# Altium schematic sheet E3Z 漫反射电子器件位置 - w版本2 20260606.SchDoc
size A1
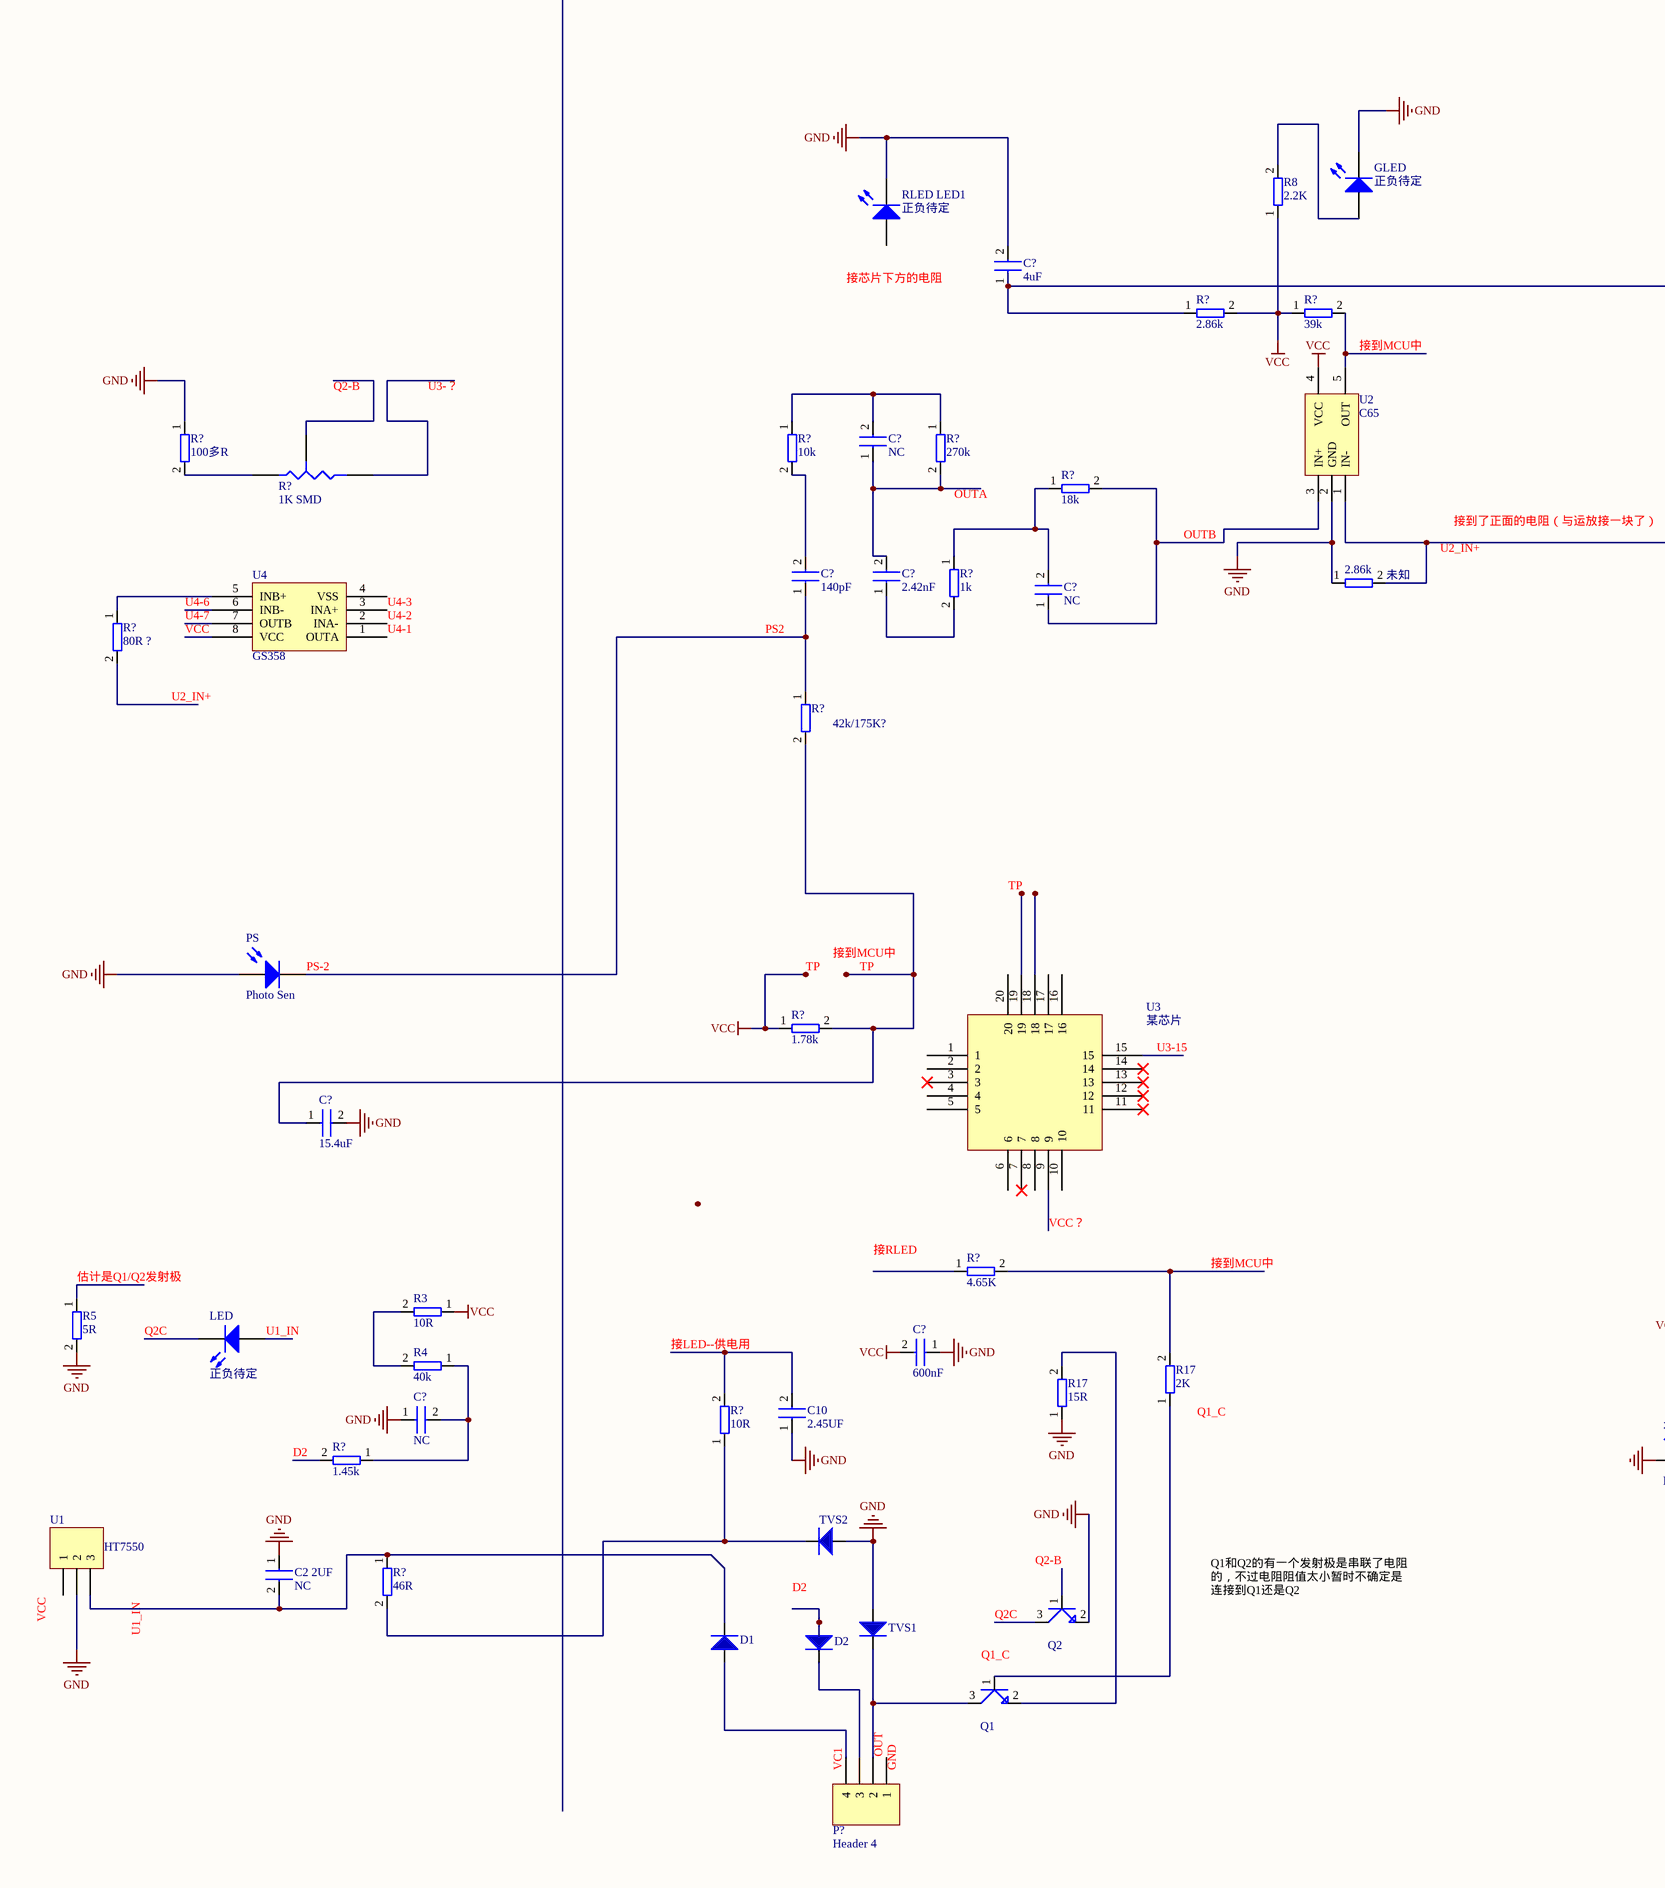
[diagram p0: E3Z 漫反射电子器件位置 - w版本2 20260606.SchDoc, left]
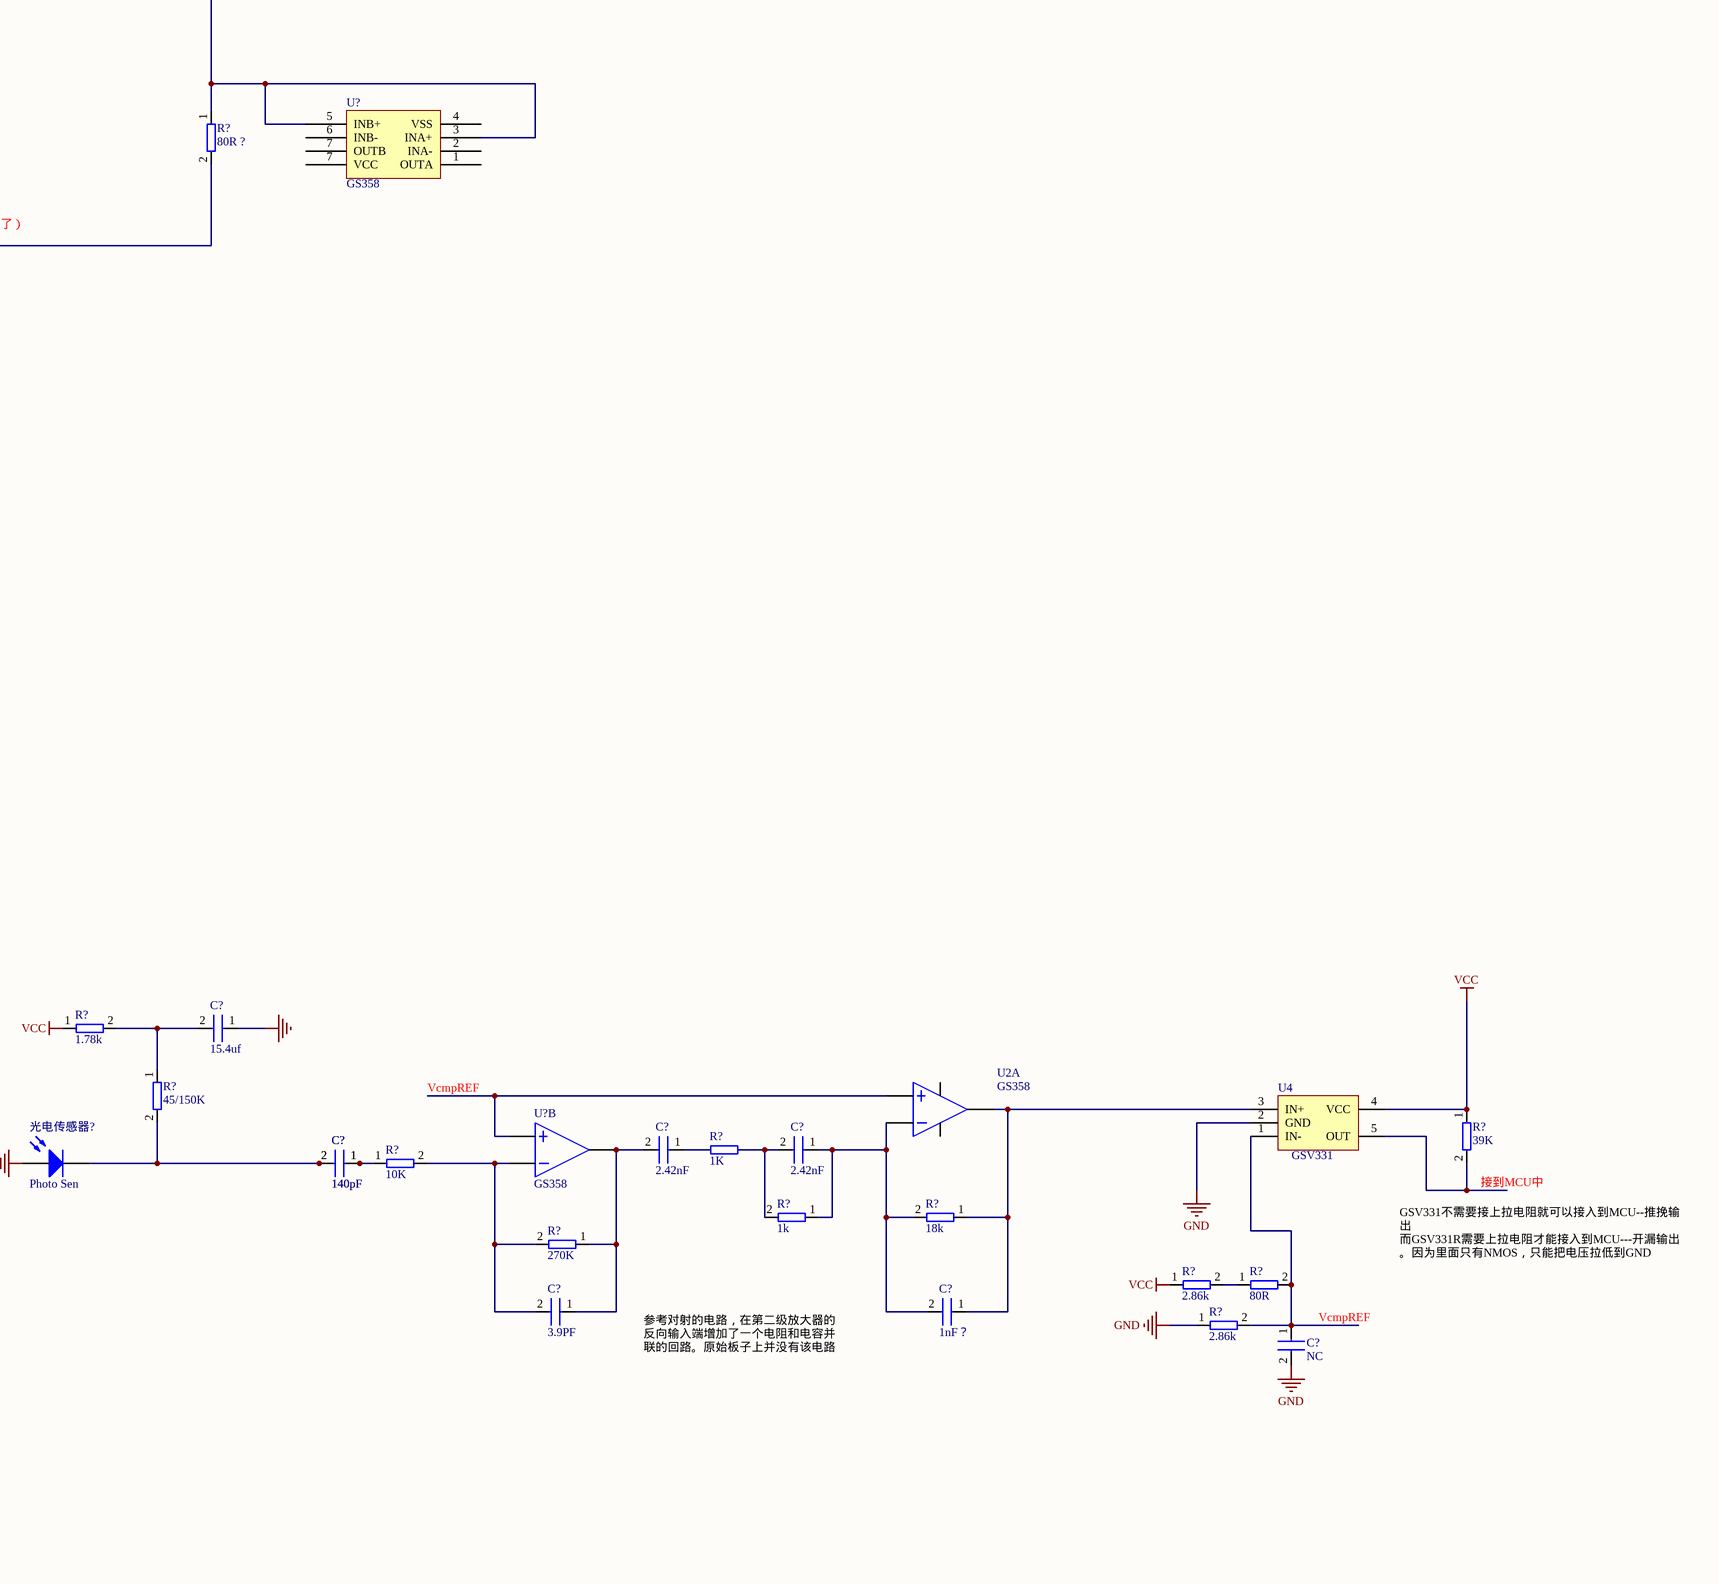
[diagram p1: E3Z 漫反射电子器件位置 - w版本2 20260606.SchDoc, right]

## Parts
(Parts that share a designator on the sheet are numbered #1, #2 ... from top to bottom, then left to right.)
2.86k  未知
C2_2UF  NC
C10  2.45UF
C?#1  4uF
C?#2  NC
C?#3  140pF
C?#4  2.42nF
C?#5  NC
C?#6  15.4uF
C?#7  15.4uf
C?#8  600nF
C?#9  NC
C?#10  2.42nF
C?#11  2.42nF
C?#12  140pF
C?#13  140pF
C?#14  3.9PF
C?#15  1nF？
C?#16  NC
D1  (no value)
D2  (no value)
GLED  正负待定  [LED-0]
LED  正负待定  [LED-0]
P?  Header 4  [HDR1X4]
PS  Photo Sen  [PIN2]
Q1  2SC4617TLR  (value not drawn)
Q2  2SC4617TLR  (value not drawn)
R3  10R
R4  40k
R5  5R
R8  2.2K
R17#1  2K
R17#2  15R
R?#1  2.86k
R?#2  39k
R?#3  80R ?
R?#4  100多R
R?#5  10k
R?#6  270k
R?#7  value 1K SMD  [VR3]  (hidden comment: Res Tap)
R?#8  18k
R?#9  1k
R?#10  80R ?
R?#11  42k/175K?
R?#12  1.78k
R?#13  4.65K
R?#14  1.78k
R?#15  45/150K
R?#16  39K
R?#17  10R
R?#18  1K
R?#19  1.45k
R?#20  10K
R?#21  1k
R?#22  18k
R?#23  270K
R?#24  46R
R?#25  2.86k
R?#26  80R
R?#27  2.86k
RLED_LED1  正负待定  [LED-0]
TVS1  (no value)
TVS2  (no value)
U1  HT7550  [HDR1X3]
U2#1  C65  [SC70]
U2#2  GS358  [SOP-8]  (part A of 2)
U3  某芯片
U4#1  GS358
U4#2  GSV331  [SC70]
U?#1  GS358
U?#2  GS358  [SOP-8]  (part B of 2)
光电传感器?  Photo Sen  [PIN2]

## Nets
GND: 2.86k.1 C2_2UF.1 C10.1 C?#1.2 C?#6.2 C?#7.1 C?#8.1 C?#9.1 C?#16.2 GLED.2(K) PS.1(A) Q2.2(E) R5.2 R17#2.1 R?#4.1 R?#27.1 RLED_LED1.2(K) TVS1.1 TVS2.1 U1.2 U2#1.2(GND) U4#2.2(GND) 光电传感器?.1(A)
VCC: C?#8.2 R3.1 R8.1 R?#1.2 R?#2.1 R?#12.1 R?#14.1 R?#16.1 R?#25.1 U2#1.4(VCC) U4#2.4(VCC)
Net2.86k_2: 2.86k.2 R?#3.2 U2#1.1(IN-)
NetC2_2UF_2: C2_2UF.2 D1.2 R?#24.1 U1.3
NetC10_2: C10.2 R?#17.2
NetC?#1_1: C?#1.1 R?#1.1 R?#3.1 U?#1.3(INA+) U?#1.5(INB+)
NetC?#2_1: C?#2.1 C?#4.2 R?#6.2
NetC?#2_2: C?#2.2 R?#5.1 R?#6.1
NetC?#3_1: C?#3.1 PS.2(K) R?#11.1
NetC?#3_2: C?#3.2 R?#5.2
NetC?#4_1: C?#4.1 R?#9.2
NetC?#5_1: C?#5.1 R?#8.2 U2#1.3(IN+)
NetC?#5_2: C?#5.2 R?#8.1 R?#9.1
NetC?#6_1: C?#6.1 R?#11.2 R?#12.2
NetC?#7_2: C?#7.2 R?#14.2 R?#15.1
NetC?#9_2: C?#9.2 R4.1 R?#19.1
NetC?#10_2: C?#10.2 C?#14.1 R?#23.1 U?#2.7
NetC?#11_1: C?#11.1 C?#15.2 R?#21.1 R?#22.2 U2#2.2
NetC?#11_2: C?#11.2 R?#21.2
NetC?#12_1: C?#12.1 C?#13.1 R?#20.1
NetC?#12_2: C?#12.2 C?#13.2 R?#15.2 光电传感器?.2(K)
NetC?#14_2: C?#14.2 R?#20.2 R?#23.2 U?#2.6
NetC?#15_1: C?#15.1 R?#22.1 U2#2.1 U4#2.3(IN+)
NetC?#16_1: C?#16.1 R?#26.2 R?#27.2 U4#2.1(IN-)
NetD1_1: D1.1 P?.4
NetD2_2: D2.2 P?.3
NetGLED_1: GLED.1(A) R8.2
NetP?_2: P?.2 Q1.3(C) TVS1.2
NetQ1_1: Q1.1(B) R17#1.1
NetQ1_2: Q1.2(E) R17#2.2
NetR3_2: R3.2 R4.2
NetR17#1_2: R17#1.2 R?#13.2
NetR?#2_2: R?#2.2 U2#1.5(OUT)
NetR?#4_2: R?#4.2 R?#7.1(A)
NetR?#10_1: R?#10.1 U4#1.5(INB+)
NetR?#16_2: R?#16.2 U4#2.5(OUT)
NetR?#17_1: R?#17.1 R?#24.2 TVS2.2
NetR?#25_2: R?#25.2 R?#26.1
NetU2#2_3: U2#2.3 U?#2.5

Not connected (* = marked no-connect by the designer): C?#10 1; D2 1; LED 1(A) 2(K); P? 1; Q2 1(B) 3(C); R5 1; R?#7 2(B) 3(TAP); R?#10 2; R?#13 1; R?#18 1 2; R?#19 2; RLED_LED1 1(A); U1 1; U2#2 4 8; U3 1 2 3* 4 5 6 7* 8 9 10 11* 12* 13* 14* 15 16 17 18 19 20; U4#1 1(OUTA) 2(INA-) 3(INA+) 4(VSS) 6(INB-) 7(OUTB) 8(VCC); U?#1 1(OUTA) 2(INA-) 4(VSS) 6(INB-) 7(OUTB)

## Notes on the sheet
- 接芯片下方的电阻
- 接到MCU中
- Q2-B
- U3-？
- (near R?#6) OUTA
- OUTB
- U2_IN+
- 接到了正面的电阻（与运放接一块了）
- VCC
- U4-6
- U4-7
- (near U4#1) U4-3
- (near U4#1) U4-2
- (near U4#1) U4-1
- PS2
- TP
- (near PS) PS-2
- U3-15
- VCC？
- (near R5) 估计是Q1/Q2发射极
- 接RLED
- Q2C
- (near LED) U1_IN
- 接LED--供电用
- (near R17#1) Q1_C
- VcmpREF
- (near R?#19) D2
- (near R?#16) 接到MCU中
- (near Q2) Q2-B
- (near U1) VCC
- U1_IN
- D2
- (near Q2) Q2C
- (near Q1) Q1_C
- GSV331不需要接上拉电阻就可以接入到MCU--推挽输出
  而GSV331R需要上拉电阻才能接入到MCU---开漏输出。因为里面只有NMOS，只能把电压拉低到GND
- (near P?) VC1
- (near P?) OUT
- (near P?) GND
- Q1和Q2的有一个发射极是串联了电阻的，不过电阻阻值太小暂时不确定是连接到Q1还是Q2
- 参考对射的电路，在第二级放大器的反向输入端增加了一个电阻和电容并联的回路。原始板子上并没有该电路

## Library data of the parts
2.86k R3-R5 R8 R17#1 R17#2 R?#1-R?#6 R?#8-R?#27 = RES
C2_2UF C10 C?#1-C?#16 = CAP
D1 D2 TVS1 TVS2 = D
GLED LED RLED_LED1 = LED0: Typical INFRARED GaAs LED; Published: 8-Jun-2000; LatestRevisionDate: 08-Jul-2005; LatestRevisionNote: Mech Layer 1 removed.; PackageReference: LED-0; Publisher: Altium Limited; PackageDescription: LED; 2 Leads
P? = Header 4: Header, 4-Pin; LatestRevisionDate: 17-Jul-2002; LatestRevisionNote: Re-released for DXP Platform.; Publisher: Altium Limited
PS 光电传感器? = Photo Sen: Photosensitive Diode; Published: 24-Mar-1999; LatestRevisionDate: 17-Jul-2002; LatestRevisionNote: Re-released for DXP Platform.; PackageReference: PIN2; Publisher: Altium Limited
Q1 Q2 = 2SC4617
R?#7 = Res Tap: Tapped Resistor; Sim Note: Enter the Resistance value and the set point into parameter fields.; Set Position: 0.5; Published: 24-Mar-1999; LatestRevisionDate: 17-Jul-2002; LatestRevisionNote: Re-released for DXP Platform.; PackageReference: VR3; Publisher: Altium Limited; PackageDescription: Variable Resistor, Thru-Hole; 3 Leads
U1 = Header 3: Header, 3-Pin; LatestRevisionDate: 17-Jul-2002; LatestRevisionNote: Re-released for DXP Platform.; Publisher: Altium Limited
U2#2 U?#2 = LM358
U4#2 = C65